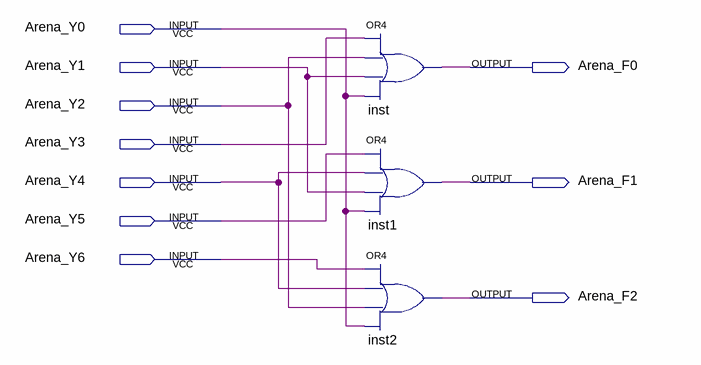
[diagram p0: schematic sheet]
// Quartus schematic Arena_8to3Encoder.bdf as structural Verilog: 3 symbols, 10 pins
module Arena_8to3Encoder (
  input  Arena_Y0,
  input  Arena_Y1,
  input  Arena_Y2,
  input  Arena_Y3,
  input  Arena_Y4,
  input  Arena_Y5,
  input  Arena_Y6,
  output Arena_F0,
  output Arena_F1,
  output Arena_F2
);

  or inst (Arena_F0, Arena_Y3, Arena_Y2, Arena_Y1, Arena_Y0);
  or inst1 (Arena_F1, Arena_Y5, Arena_Y4, Arena_Y1, Arena_Y0);
  or inst2 (Arena_F2, Arena_Y6, Arena_Y4, Arena_Y2, Arena_Y0);
endmodule
